# EAGLE design mk-driver (EAGLE 4.16)
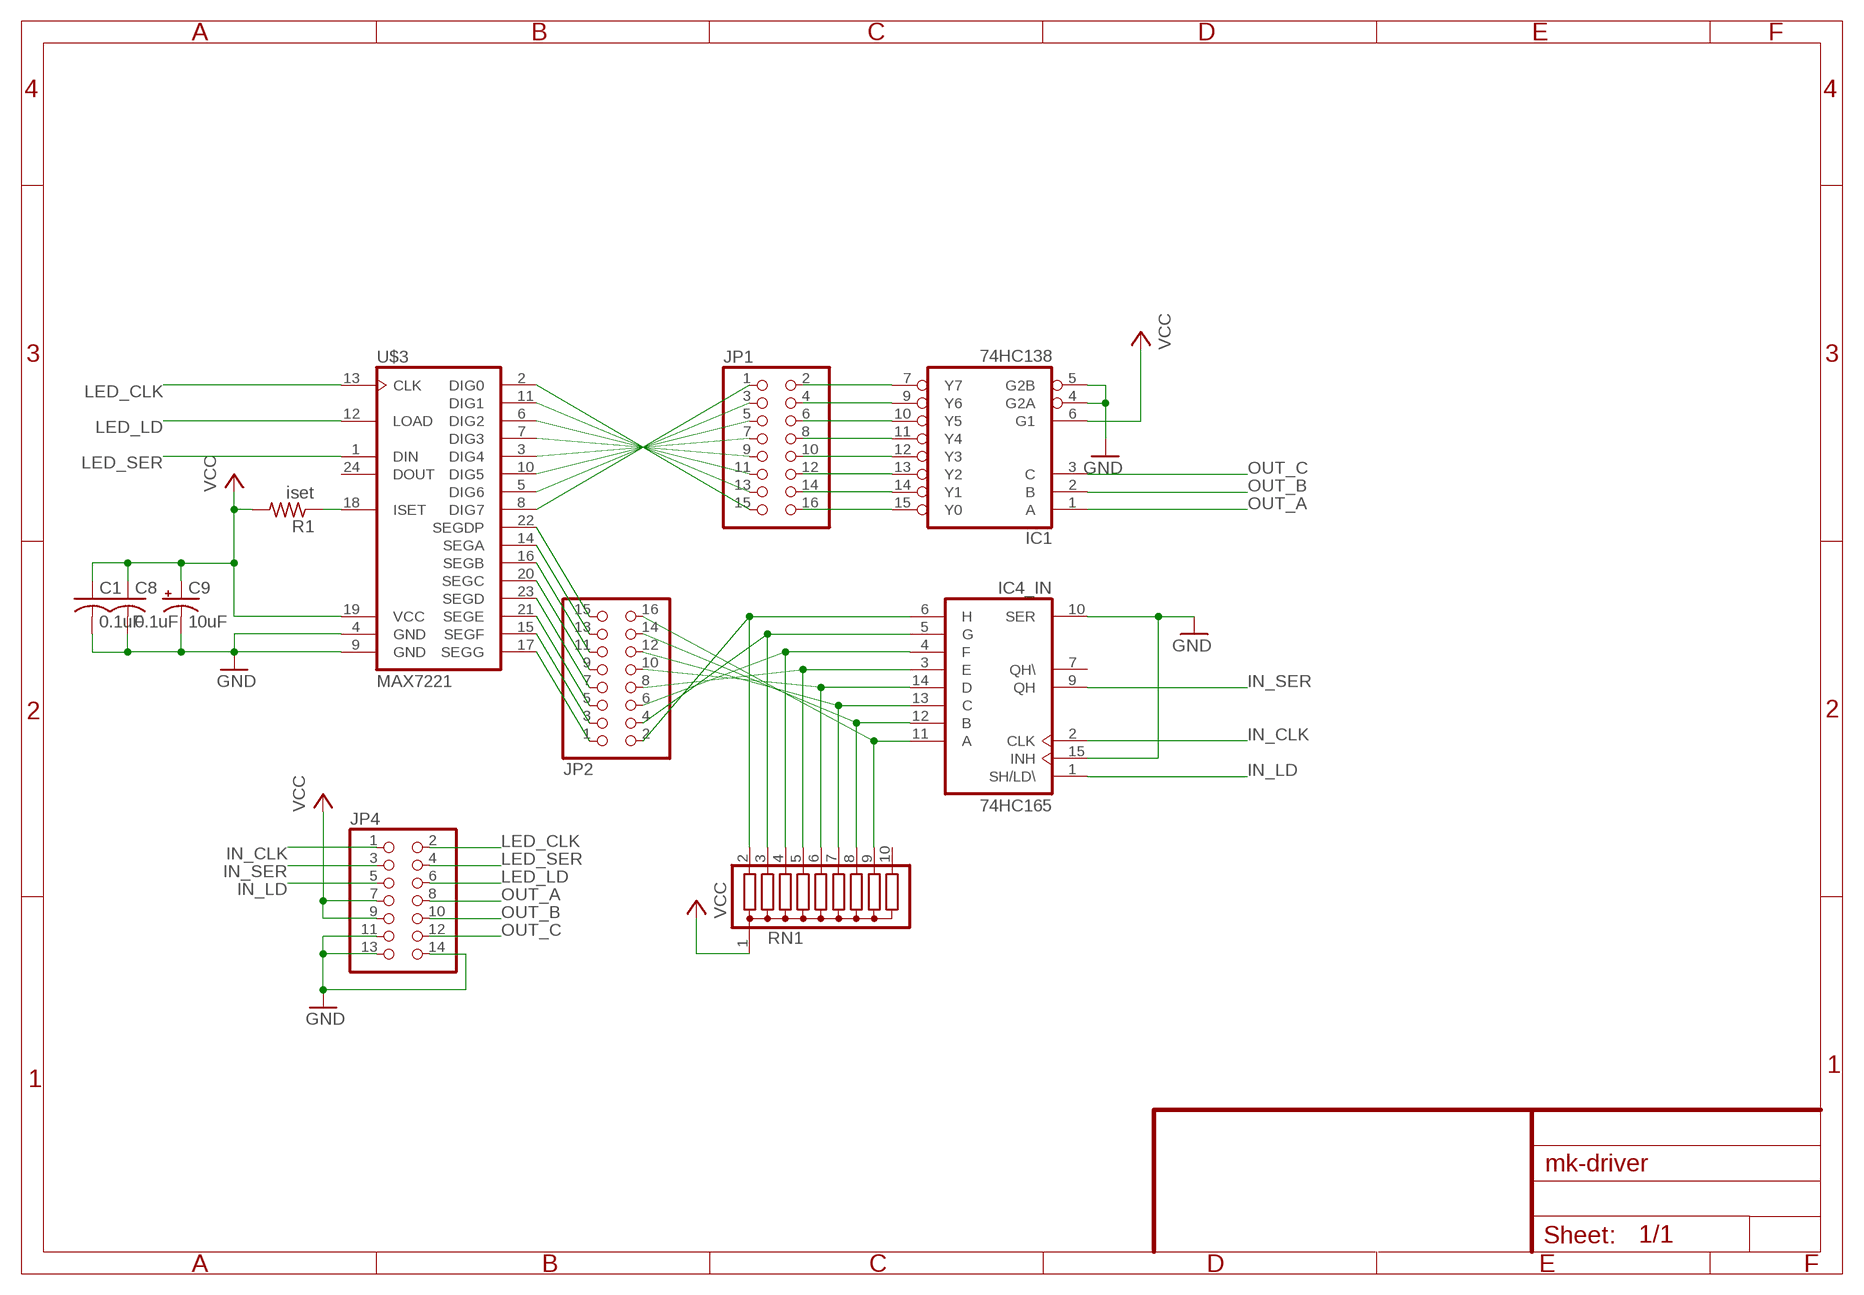
[diagram p0: schematic, sheet 1]

## Parts
C1  0.1uF  C-US050-025X075  [C050-025X075]
C8  0.1uF  C-US050-025X075  [C050-025X075]
C9  10uF  CPOL-USTT2D4  [TT2D4]
IC1  74HC138  74LS138N  [DIL16]
IC4_IN  74HC165  74LS165N  [DIL16]
JP1  PINHD-2X8  [2X08]
JP2  PINHD-2X8  [2X08]
JP4  PINHD-2X7  [2X07]
R1  iset  R-US_0207/7  [0207/7]
RN1  G09R  [SIL10]
U$3  MAX7221  [DIP24SKI]

## Nets
GND: C1.2 C8.2 C9.- IC1.4(G2A) IC1.5(G2B) IC4_IN.10(SER) IC4_IN.15(INH) JP4.11 JP4.13 JP4.14 U$3.4(GND) U$3.9(GND)
IN_CLK: IC4_IN.2(CLK) JP4.1
IN_LD: IC4_IN.1(SH/LD\) JP4.5
IN_SER: IC4_IN.9(QH) JP4.3
LED_CLK: JP4.2 U$3.13(CLK)
LED_LD: JP4.6 U$3.12(LOAD)
LED_SER: JP4.4 U$3.1(DIN)
N$1: JP1.1 U$3.8(DIG7)
N$2: JP1.3 U$3.5(DIG6)
N$3: JP1.5 U$3.10(DIG5)
N$4: JP1.7 U$3.3(DIG4)
N$5: JP1.9 U$3.7(DIG3)
N$6: JP1.11 U$3.6(DIG2)
N$7: JP1.13 U$3.11(DIG1)
N$8: JP1.15 U$3.2(DIG0)
N$9: JP2.1 U$3.17(SEGG)
N$10: JP2.3 U$3.15(SEGF)
N$11: JP2.5 U$3.21(SEGE)
N$12: JP2.7 U$3.23(SEGD)
N$13: JP2.9 U$3.20(SEGC)
N$14: JP2.11 U$3.16(SEGB)
N$15: JP2.13 U$3.14(SEGA)
N$16: JP2.15 U$3.22(SEGDP)
N$17: R1.1 U$3.18(ISET)
N$18: IC4_IN.6(H) JP2.2 RN1.2
N$22: IC4_IN.11(A) JP2.16 RN1.9
N$23: IC1.15(Y0) JP1.16
N$24: IC1.14(Y1) JP1.14
N$25: IC1.13(Y2) JP1.12
N$26: IC1.12(Y3) JP1.10
N$27: IC1.11(Y4) JP1.8
N$28: IC1.10(Y5) JP1.6
N$29: IC1.9(Y6) JP1.4
N$30: IC1.7(Y7) JP1.2
N$31: IC4_IN.5(G) JP2.4 RN1.3
N$32: IC4_IN.4(F) JP2.6 RN1.4
N$33: IC4_IN.3(E) JP2.8 RN1.5
N$34: IC4_IN.14(D) JP2.10 RN1.6
N$35: IC4_IN.13(C) JP2.12 RN1.7
N$36: IC4_IN.12(B) JP2.14 RN1.8
OUT_A: IC1.1(A) JP4.8
OUT_B: IC1.2(B) JP4.10
OUT_C: IC1.3(C) JP4.12
VCC: C1.1 C8.1 C9.+ IC1.6(G1) JP4.7 JP4.9 R1.2 RN1.1 U$3.19(VCC)
Unconnected: IC4_IN.7(QH\) RN1.10 U$3.24(DOUT)

## Power pins joined to a net without a drawn wire
GND: IC1.8(GND) IC4_IN.8(GND)
VCC: IC1.16(VCC) IC4_IN.16(VCC)

## Library data of the parts
C1 C8 = rcl:C-US: CAPACITOR, American symbol
C9 = rcl:CPOL-US: POLARIZED CAPACITOR, American symbol
IC1 = 74xx-us:74*138: 3-line to 8-line DECODER/DEMULTIPLEXER
IC4_IN = monome:74*165: 8-bit parallel load SHIFT REGISTER
JP1 JP2 = pinhead:PINHD-2X8: PIN HEADER
JP4 = pinhead:PINHD-2X7: PIN HEADER
R1 = rcl:R-US_: RESISTOR, American symbol
RN1 = resistor-sil:G09R: SIL RESISTOR
U$3 = monome:MAX7221

## Board
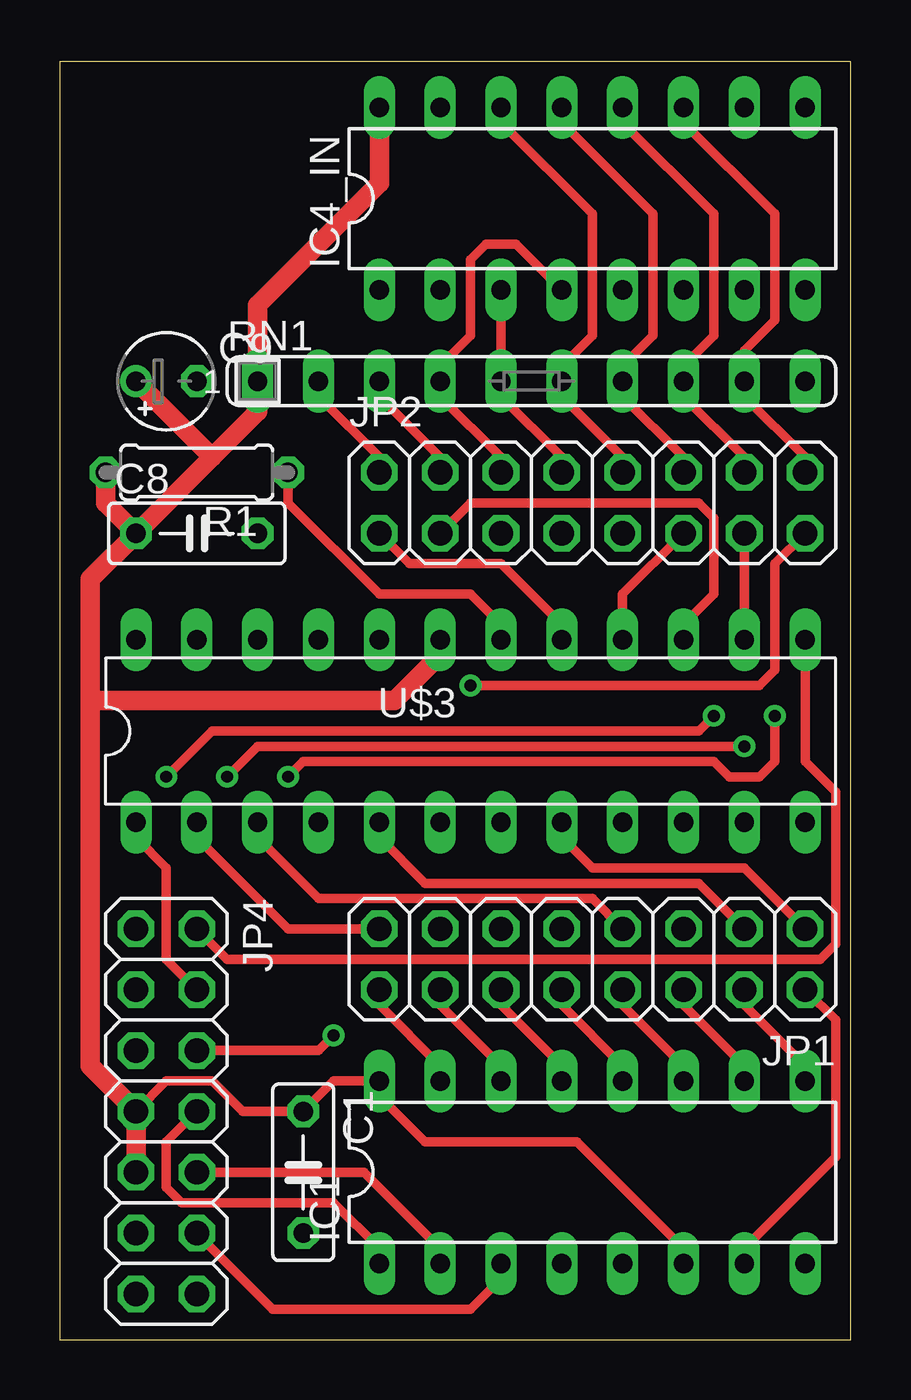
[diagram p1: board, top side]
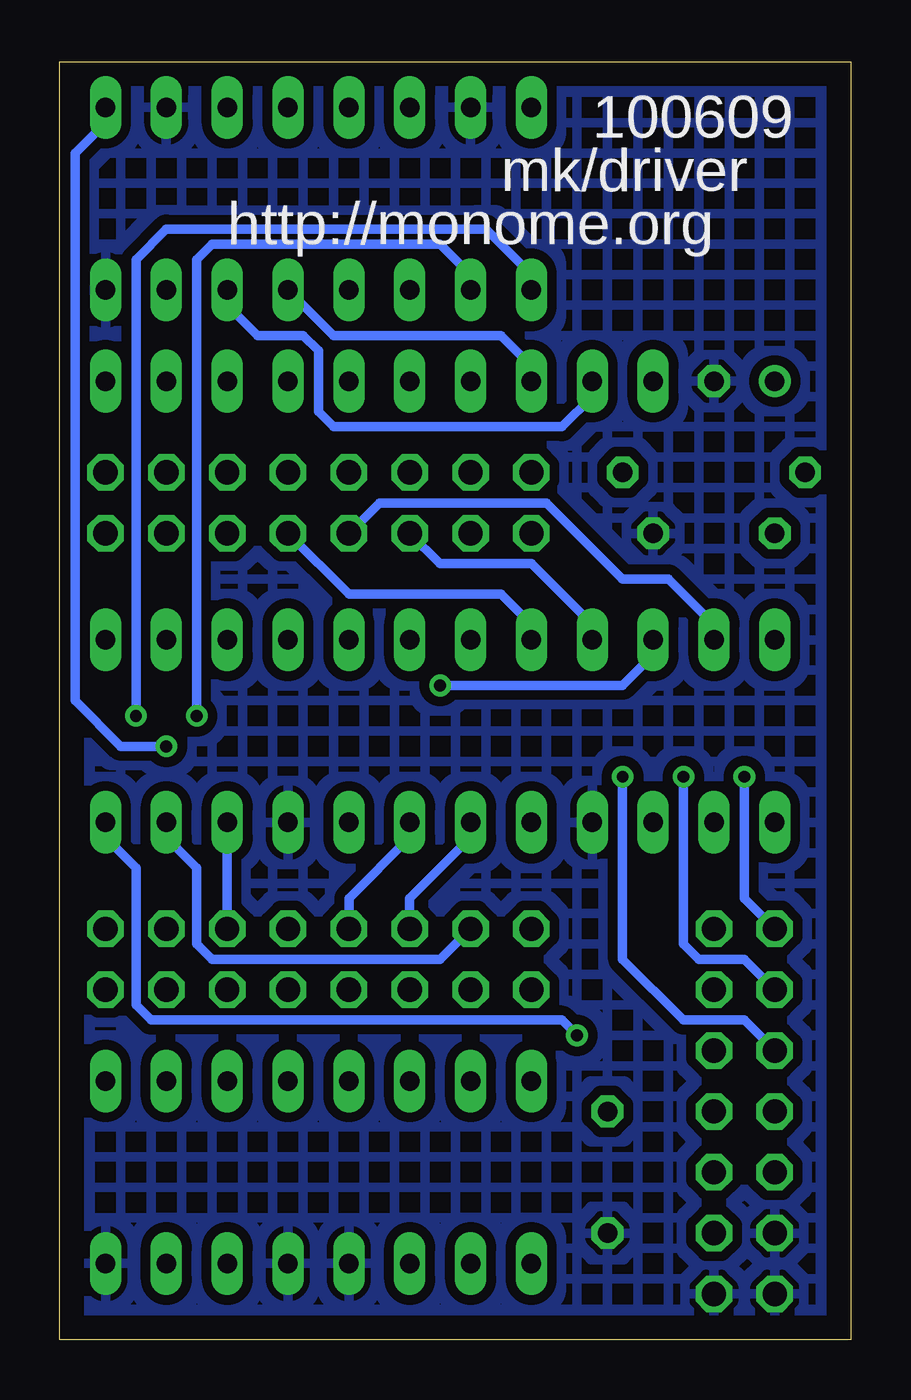
[diagram p2: board, bottom side, seen from below]

Size 33.02 x 53.34 mm. Coordinates in mm from the lower left corner, seen from the top.
Outline: 0,0 33.02,0 33.02,53.34 0,53.34 0,0
Copper layers (1+16): Top 0.035mm / dielectric 1.5mm / Bottom 0.035mm
Design rules "default": minimum track width 10mil, minimum drill 24mil, track to track 8mil, track to pad 8mil, pad to pad 8mil, via to via 8mil, smd to smd 8mil, copper to edge 40mil, drill to drill 8mil, minimum pad ring 10mil, minimum via ring 8mil, stop-mask expansion 4mil, vias tented up to drill 0mil, thermal gap 10mil

### Footprints (pad centres in the part's own frame; a part is rotated, then mirrored left to right if it is on the bottom)
C050-025X075 = drill 0.813 octagon: 1 -2.54,0; 2 2.54,0
TT2D4 = drill 0.813 round: + -1.27,0 | drill 0.813 octagon: - 1.27,0
DIL16 = drill 0.813 long: 1 -8.89,-3.81; 2 -6.35,-3.81; 3 -3.81,-3.81; 4 -1.27,-3.81; 5 1.27,-3.81; 6 3.81,-3.81; 7 6.35,-3.81; 8 8.89,-3.81; 9 8.89,3.81; 10 6.35,3.81; 11 3.81,3.81; 12 1.27,3.81; 13 -1.27,3.81; 14 -3.81,3.81; 15 -6.35,3.81; 16 -8.89,3.81
2X08 = drill 1.016 octagon: 1 -8.89,-1.27; 2 -8.89,1.27; 3 -6.35,-1.27; 4 -6.35,1.27; 5 -3.81,-1.27; 6 -3.81,1.27; 7 -1.27,-1.27; 8 -1.27,1.27; 9 1.27,-1.27; 10 1.27,1.27; 11 3.81,-1.27; 12 3.81,1.27; 13 6.35,-1.27; 14 6.35,1.27; 15 8.89,-1.27; 16 8.89,1.27
2X07 = drill 1.016 octagon: 1 -7.62,-1.27; 2 -7.62,1.27; 3 -5.08,-1.27; 4 -5.08,1.27; 5 -2.54,-1.27; 6 -2.54,1.27; 7 0,-1.27; 8 0,1.27; 9 2.54,-1.27; 10 2.54,1.27; 11 5.08,-1.27; 12 5.08,1.27; 13 7.62,-1.27; 14 7.62,1.27
0207/7 = drill 0.813 octagon: 1 -3.81,0; 2 3.81,0
SIL10 = drill 0.813 long: 1 -11.43,0; 2 -8.89,0; 3 -6.35,0; 4 -3.81,0; 5 -1.27,0; 6 1.27,0; 7 3.81,0; 8 6.35,0; 9 8.89,0; 10 11.43,0
DIP24SKI = drill 0.813 pad 1.27 long: 1 -11.43,-3.81; 2 -8.89,-3.81; 3 -6.35,-3.81; 4 -3.81,-3.81; 5 -1.27,-3.81; 6 1.27,-3.81; 7 3.81,-3.81; 8 6.35,-3.81; 9 8.89,-3.81; 10 11.43,-3.81; 11 13.97,-3.81; 12 16.51,-3.81; 13 16.51,3.81; 14 13.97,3.81; 15 11.43,3.81; 16 8.89,3.81; 17 6.35,3.81; 18 3.81,3.81; 19 1.27,3.81; 20 -1.27,3.81; 21 -3.81,3.81; 22 -6.35,3.81; 23 -8.89,3.81; 24 -11.43,3.81

### Placement (x,y rotation side)
C1  10.16,6.99 270 top
C8  5.71,33.66 0 top
C9  4.45,40.01 0 top
IC1  22.23,6.99 0 top
IC4_IN  22.23,47.62 0 top
JP1  22.23,15.88 180 top
JP2  22.23,34.92 0 top
JP4  4.45,9.53 270 top
R1  5.71,36.2 180 top
RN1  19.68,40.01 0 top
U$3  14.61,25.4 0 top

### Tracks (layer width: path | path; a pad name or v marks a point on that pad's centre or on a via)
GND
  pour Bottom (isolate 0.406, hatched): 0,0 33.02,0 33.02,53.34 0,53.34
IN_CLK  (via drill 0.5)
  Top 0.406: v27.3,26.04 26.67,25.4 6.35,25.4 v4.45,23.5
  Bottom 0.406: v4.45,23.5 4.45,18.41 JP4.1 | IC4_IN.2 15.88,44.45 17.14,45.72 26.67,45.72 27.3,45.09 v27.3,26.04
IN_LD  (via drill 0.5)
  Top 0.406: v9.53,23.5 10.16,24.13 27.3,24.13 27.94,23.5 29.21,23.5 29.84,24.13 v29.84,26.04
  Bottom 0.406: v9.53,23.5 9.53,15.88 6.99,13.34 4.45,13.34 JP4.5 | IC4_IN.1 13.34,44.45 15.24,46.35 28.57,46.35 29.84,45.09 v29.84,26.04
IN_SER  (via drill 0.5)
  Top 0.406: v6.99,23.5 8.26,24.77 v28.57,24.77
  Bottom 0.406: v6.99,23.5 6.99,16.51 6.35,15.88 4.45,15.88 JP4.3 | IC4_IN.9 31.11,50.8 32.38,49.53 32.38,26.67 30.48,24.77 v28.57,24.77
LED_CLK
  Top 0.406: U$3.13 31.11,24.13 32.38,22.86 32.38,16.51 31.75,15.88 6.99,15.88 JP4.2
LED_LD  (via drill 0.5)
  Top 0.406: v11.43,12.7 10.79,12.06 JP4.6
  Bottom 0.406: v11.43,12.7 12.06,13.34 29.21,13.34 29.84,13.97 29.84,19.68 31.11,20.95 U$3.12
LED_SER
  Top 0.406: U$3.1 3.17,20.95 4.45,19.68 4.45,15.88 JP4.4
N$1
  Top 0.406: U$3.8 20.95,20.95 22.23,19.68 28.57,19.68 JP1.1
N$2
  Top 0.406: U$3.5 13.34,20.95 15.24,19.05 26.67,19.05 JP1.3
N$3
  Bottom 0.406: JP1.5 U$3.10
N$4
  Top 0.406: U$3.3 8.26,20.95 10.79,18.41 22.23,18.41 JP1.7
N$5
  Bottom 0.406: U$3.7 18.41,20.95 20.95,18.41 JP1.9
N$6
  Bottom 0.406: U$3.6 15.88,20.95 18.41,18.41 JP1.11
N$7
  Bottom 0.406: JP1.13 17.14,15.88 26.67,15.88 27.3,16.51 27.3,19.68 28.57,20.95 U$3.11
N$8
  Top 0.406: U$3.2 5.71,20.95 9.53,17.14 JP1.15
N$9
  Top 0.406: JP2.1 14.61,32.38 18.41,32.38 20.95,29.84 U$3.17
N$10
  Top 0.406: JP2.3 17.14,34.92 26.67,34.92 27.3,34.29 27.3,31.11 26.04,29.84 U$3.15
N$11
  Bottom 0.406: JP2.5 17.14,32.38 13.34,32.38 10.79,29.84 U$3.21
N$12
  Bottom 0.406: JP2.7 19.68,34.92 12.7,34.92 9.53,31.75 7.62,31.75 5.71,29.84 U$3.23
N$13
  Bottom 0.406: U$3.20 13.34,29.84 14.61,31.11 20.95,31.11 JP2.9
N$14
  Top 0.406: U$3.16 23.5,31.11 JP2.11
N$15
  Top 0.406: U$3.14 JP2.13
N$16  (via drill 0.5)
  Top 0.406: v17.14,27.3 29.21,27.3 29.84,27.94 29.84,32.38 JP2.15
  Bottom 0.406: U$3.22 8.26,28.57 9.53,27.3 v17.14,27.3
N$17
  Top 0.406: U$3.18 18.41,29.84 17.14,31.11 13.34,31.11 9.53,34.92 R1.1
N$18
  Top 0.406: JP2.2 13.34,36.83 10.79,39.37 RN1.2
  Bottom 0.406: IC4_IN.6 26.04,43.18 24.77,41.91 22.86,41.91 22.23,41.27 22.23,38.73 21.59,38.1 12.06,38.1 10.79,39.37 RN1.2
N$22
  Top 0.406: JP2.16 31.11,36.83 28.57,39.37 RN1.9 28.57,41.27 29.84,42.55 29.84,46.99 26.04,50.8 IC4_IN.11
N$23
  Top 0.406: JP1.16 13.34,13.97 15.88,11.43 IC1.15
N$24
  Top 0.406: JP1.14 15.88,13.97 18.41,11.43 IC1.14
N$25
  Top 0.406: JP1.12 18.41,13.97 20.95,11.43 IC1.13
N$26
  Top 0.406: JP1.10 20.95,13.97 23.5,11.43 IC1.12
N$27
  Top 0.406: JP1.8 23.5,13.97 26.04,11.43 IC1.11 26.04,10.16
N$28
  Top 0.406: JP1.6 26.04,13.97 28.57,11.43 IC1.10
N$29
  Top 0.406: JP1.4 28.57,13.97 31.11,11.43 IC1.9
N$30
  Top 0.406: JP1.2 32.38,13.34 32.38,7.62 28.57,3.81 IC1.7
N$31
  Top 0.406: JP2.4 15.88,36.83 13.34,39.37 RN1.3
  Bottom 0.406: IC4_IN.5 21.59,41.91 14.61,41.91 13.34,40.64 RN1.3
N$32
  Top 0.406: JP2.6 18.41,36.83 15.88,39.37 RN1.4 15.88,40.64 17.14,41.91 17.14,45.09 17.78,45.72 19.05,45.72 IC4_IN.4
N$33
  Top 0.406: JP2.8 20.95,36.83 18.41,39.37 RN1.5 IC4_IN.3
N$34
  Top 0.406: JP2.10 23.5,36.83 20.95,39.37 RN1.6 20.95,40.64 22.23,41.91 22.23,46.99 18.41,50.8 IC4_IN.14
N$35
  Top 0.406: JP2.12 26.04,36.83 23.5,39.37 RN1.7 23.5,40.64 24.77,41.91 24.77,46.99 20.95,50.8 IC4_IN.13
N$36
  Top 0.406: JP2.14 28.57,36.83 26.04,39.37 RN1.8 26.04,40.64 27.3,41.91 27.3,46.99 23.5,50.8 IC4_IN.12
OUT_A
  Top 0.406: JP4.8 4.45,8.26 4.45,6.35 5.08,5.71 11.43,5.71 13.34,3.81 IC1.1
OUT_B
  Top 0.406: IC1.2 15.88,3.81 12.7,6.99 JP4.10
OUT_C
  Top 0.406: JP4.12 8.89,1.27 17.14,1.27 18.41,2.54 IC1.3
VCC
  Top 0.406: IC1.6 26.04,3.81 21.59,8.26 15.24,8.26 13.34,10.16 IC1.16 11.43,10.79 C1.1 7.62,9.53 6.35,10.79 4.45,10.79 JP4.7
  Top 0.813: IC4_IN.16 13.34,48.26 8.26,43.18 RN1.1 8.26,38.73 6.35,36.83 | C8.1 6.35,36.83 | U$3.19 15.88,28.57 13.97,26.67 1.27,26.67 | 1.27,26.67 1.27,31.75 C8.1 | 6.35,36.83 C9.+ | R1.2 1.91,34.92 C8.1 | 1.27,26.67 1.27,11.43 JP4.7 JP4.9

### Text on the board
bPlace: 100609 | mk/driver | http://monome.org